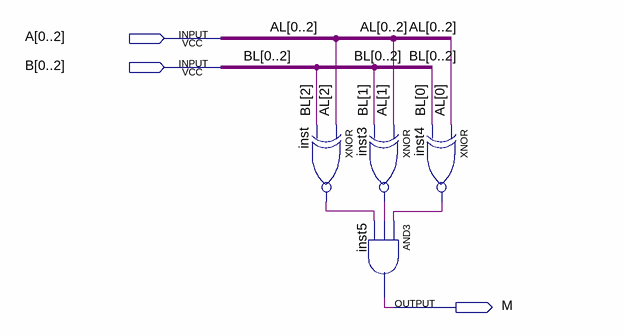
[diagram p0: schematic sheet]
// Quartus schematic Comparer3.bdf as structural Verilog: 4 symbols, 3 pins
module Comparer3 (
  input  [0:2] A,
  input  [0:2] B,
  output M
);

  wire inst3_out, inst4_out, inst_out;

  xnor inst (inst_out, A[2], B[2]);
  xnor inst3 (inst3_out, A[1], B[1]);
  and inst5 (M, inst4_out, inst3_out, inst_out);
  xnor inst4 (inst4_out, A[0], B[0]);

  // Other names for the same wires on the sheet: AL[2:0] = {A[2], A[1], A[0]}; BL[2:0] = {B[2], B[1], B[0]}
endmodule
